# Altium project Yer_Istasyonu.PrjPcb
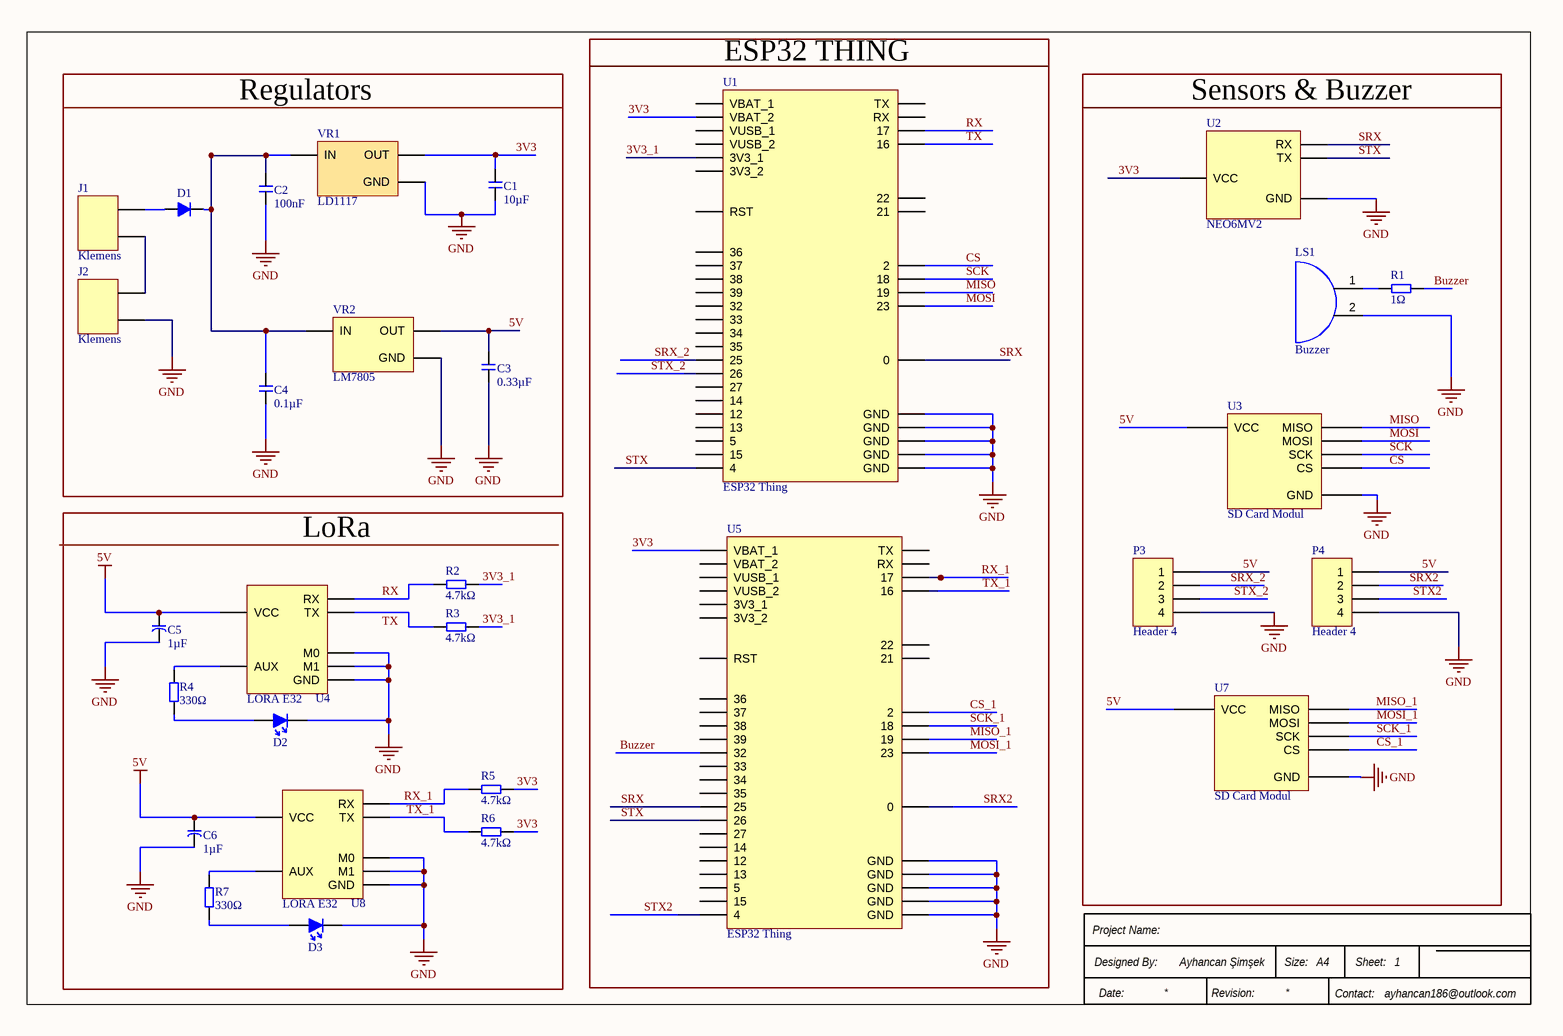
[diagram p0: Sheet1.SchDoc]
1 sheet, 30 parts. Net scope: global (net labels, ports and power ports of the same name join across sheets).
Board file: PCB1.PcbDoc

## Sheet Sheet1.SchDoc
size A4; SheetNumber: 1; SheetTotal: 1

### Parts
C1  10µF  [LCapacitor]
C2  100nF  [LCapacitor]
C3  0.33µF  [LCapacitor]
C4  0.1µF  [LCapacitor]
C5  1µF  [Capacitor]
C6  1µF  [Capacitor]
D1  Diode  [Zener]  (value not drawn)
D2  Led  [LED]  (value not drawn)
D3  Led  [LED]  (value not drawn)
J1  Klemens  [Klemens]
J2  Klemens  [Klemens]
LS1  Buzzer  [Buzzer]
P3  Header 4  [HDR1X4]
P4  Header 4  [HDR1X4]
R1  1Ω  [Resistor]
R2  4.7kΩ  [Resistor]
R3  4.7kΩ  [Resistor]
R4  330Ω  [Resistor]
R5  4.7kΩ  [Resistor]
R6  4.7kΩ  [Resistor]
R7  330Ω  [Resistor]
U1  ESP32 Thing  [ESP32 THING]
U2  NEO6MV2  [NEO6MV2]
U3  SD Card Modul  [SD Card Modülü]
U4  LORA E32  [LORAE32]
U5  ESP32 Thing  [ESP32 THING]
U7  SD Card Modul  [SD Card Modülü]
U8  LORA E32  [LORAE32]
VR1  LD1117  [LD1117]
VR2  LM7805  [LM7805]

### Blocks framed on the sheet
Regulators: C1-C4 D1 J1 J2 VR1 VR2
ESP32 THING: U1 U5
Sensors & Buzzer: LS1 P3 P4 R1 U2 U3 U7
LoRa: C5 C6 D2 D3 R2-R7 U4 U8

### Nets
5V: C3.2 C5.1 C6.1 P3.1 P4.1 U3.0(VCC) U4.2(VCC) U7.0(VCC) U8.2(VCC) VR2.3(OUT)
GND: C1.1 C2.1 C3.1 C4.1 C5.2 C6.2 D2.1 D3.1 J2.1 LS1.2 P3.4 P4.4 U1.GND_1(GND) U1.GND_2(GND) U1.GND_3(GND) U1.GND_4(GND) U1.GND_5(GND) U2.4(GND) U3.5(GND) U4.1(GND) U4.6(M1) U4.7(M0) U5.GND_1(GND) U5.GND_2(GND) U5.GND_3(GND) U5.GND_4(GND) U5.GND_5(GND) U7.5(GND) U8.1(GND) U8.6(M1) U8.7(M0) VR1.3(GND) VR2.2(GND)
3V3: C1.2 R5.2 R6.2 U1.VBAT_2 U2.1(VCC) U5.VBAT_1 VR1.2(OUT)
3V3_1: R2.2 R3.2 U1.3V3_1
Buzzer: R1.1 U5.32
CS: U1.2 U3.4(CS)
CS_1: U5.2 U7.4(CS)
MISO: U1.19 U3.3(MISO)
MISO_1: U5.19 U7.3(MISO)
MOSI: U1.23 U3.2(MOSI)
MOSI_1: U5.23 U7.2(MOSI)
RX: R2.1 U1.17 U4.5(RX)
RX_1: R5.1 U5.17 U8.5(RX)
SCK: U1.18 U3.1(SCK)
SCK_1: U5.18 U7.1(SCK)
SRX: U1.0 U2.2(RX) U5.25
SRX2: P4.2 U5.0
SRX_2: P3.2 U1.25
STX: U1.4 U2.3(TX) U5.26
STX2: P4.3 U5.4
STX_2: P3.3 U1.26
TX: R3.1 U1.16 U4.4(TX)
TX_1: R6.1 U5.16 U8.4(TX)
NetC2_2: C2.2 C4.2 D1.2 VR1.1(IN) VR2.1(IN)
NetD1_1: D1.1 J1.0
NetD2_2: D2.2 R4.1
NetD3_2: D3.2 R7.1
NetJ1_1: J1.1 J2.0
NetLS1_1: LS1.1 R1.2
NetR4_2: R4.2 U4.3(AUX)
NetR7_2: R7.2 U8.3(AUX)

Not connected (* = marked no-connect by the designer): U1 3V3_2 5 12 13 14 15 21 22 27 32 33 34 35 36 37 38 39 RST RX TX VBAT_1 VUSB_1 VUSB_2; U5 3V3_1 3V3_2 5 12 13 14 15 21 22 27 33 34 35 36 37 38 39 RST RX TX VBAT_2 VUSB_1 VUSB_2

### Notes on the sheet
- Date:
- Project Name:
- Designed By:
- Ayhancan Şimşek
- Revision:
- Size:
- A4
- Contact:
- Sheet:
- ayhancan186@outlook.com

### Library data of the parts
C1-C4 = Capacitor
C5 C6 = DCapacitor
P3 P4 = Header 4: Header, 4-Pin; LatestRevisionDate: 17-Jul-2002; LatestRevisionNote: Re-released for DXP Platform.; Publisher: Altium Limited
R1-R7 = Resistor
U1 U5 = ESP32 Thing: ESP32 802.11 Wireless LAN/Combo Wireless Module Development Kit; Manufacturer: SparkFun; Manufacturer Part Number: DEV-13907; Frequency: 2.4GHz; Supplier 1: Digi-Key; RoHS: No; Category: RF Semiconductors and Devices; Stock 1: 568; Pricing 1: 1=23,50000 (USD); ComponentLink1URL: https://github.com/sparkfun/ESP32_Thing?src-supplier=Digi-Key; ComponentLink1Description: https://github.com/sparkfun/ESP32_Thing?src-supplier=Digi-Key; Supplier Part Number 1: 1568-1444-ND
U2 = NEO6MV2: U#NEO-6M Gps Module U-BLOX6 SMD24P; Manufacturer: u-blox; Manufacturer Part Number: NEO-6M-0; Supplier 1: Mouser; RoHS: Yes; Stock 1: 236; Pricing 1: 1=60,00000, 10=41,87000, 50=27,23000, 100=17,72000, 1000=17,72000, 10000=17,72000 (USD); RoHS Compliant: Yes; Supplier Part Number 1: 377-NEO-6M-0
U4 U8 = LORA E32: WiFi-Modul 802.11/BT 2, 4-2, 5GHz 150Mb/s; Manufacturer: Espressif Systems; Manufacturer Part Number: ESP32-S3-WROOM-1-N16R8; Supplier 1: Digi-Key; RoHS: No; Category: Uncategorized; Stock 1: 327; Pricing 1: 1=4,29000 (USD); Supplier Part Number 1: 1965-ESP32-S3-WROOM-1-N16R8CT-ND
VR1 = LD1117: LDO Regulator Pos 3.3V 1.3A 3-Pin(3+Tab) TO-220 Tube (Alt: LD1117V33C); Manufacturer: STMicroelectronics; Number of Outputs: 1; Max Input Voltage: 15V; Max Power Dissipation: 12W; Polarity: Positive; Quiescent Current: 10mA; Accuracy: 1%; Output Type: Fixed; Output Current: 800mA; Dropout Voltage: 1.1V; Input Bias Current: 5mA; Supplier 1: Digi-Key; Manufacturer Part Number: LD1117V33C; RoHS: Yes; Category: Voltage Regulators - Linear; Stock 1: 30; Pricing 1: 1=0,84000, 10=0,74000, 25=0,69520, 100=0,56750, 250=0,52708, 500=0,44860, 1000=0,37030 (USD); Mount: Through Hole; Case/Package: TO; Number of Pins: 3; Weight: 0.02lb; Min Operating Temperature: -40°C; Max Operating Temperature: 125°C; Output Voltage: 3.3V; Max Output Current: 1.3A; Packaging: Rail/Tube; Number of Regulators: 1; Package Quantity: 50; Nominal Output Voltage: 3.3V; Power Dissipation: 12W; Min Output Voltage: 3.3V; Output Voltage Accuracy: 1%; Series: -; Length: 10.4mm; Width: 4.6mm; Height: 9.15mm; Radiation Hardening: No; RoHS Compliant: Yes; REACH SVHC: No SVHC; Lead Free: Lead Free; ComponentLink1URL: https://datasheet.ciiva.com/1511/1776449-1511580.pdf?src-supplier=Element14; ComponentLink1Description: https://datasheet.ciiva.com/1511/1776449-1511580.pdf?src-supplier=Element14; ComponentLink2URL: https://datasheet.ciiva.com/16226/cd00000544-16226333.pdf?src-supplier=Future+Electronics; ComponentLink2Description: https://datasheet.ciiva.com/16226/cd00000544-16226333.pdf?src-supplier=Future+Electronics; ComponentLink3URL: https://datasheet.ciiva.com/2044/cd00000544-2044110.pdf?src-supplier=Digi-Key; ComponentLink3Description: https://datasheet.ciiva.com/2044/cd00000544-2044110.pdf?src-supplier=Digi-Key; Supplier Part Number 1: 497-1492-5-ND
VR2 = LM7805: LM78XX Series 5 V Fixed Output 1 A 3-Terminal LDO Voltage Regulator - TO-220; Manufacturer: ON Semiconductor / Fairchild; Manufacturer Part Number: LM7805CT; Output Voltage: 5V; Number of Outputs: 1; Max Input Voltage: 35V; Output Current: 1A; Min Input Voltage: 7V; Polarity: Positive; Dropout Voltage: 2V; Quiescent Current: 8mA; Accuracy: 4%; Power Supply Rejection Ratio (PSRR): 73dB; Max Output Voltage: 5.2V; Supplier 1: Digi-Key; RoHS: Yes; Category: Voltage Regulators - Linear; Mount: Through Hole; Case/Package: TO-220-3; Number of Pins: 3; Weight: 1.214g; Min Operating Temperature: -40°C; Max Operating Temperature: 125°C; Packaging: Rail/Tube; Output Type: Fixed; Max Output Current: 1A; Number of Regulators: 1; Output Voltage Accuracy: 4%; Package Quantity: 50; Current Rating: 1A; Nominal Output Voltage: 5V; Min Output Voltage: 5V; Length: 10.67mm; Width: 4.7mm; Height: 16.3mm; Radiation Hardening: No; RoHS Compliant: Yes; Lead Free: Lead Free; REACH SVHC: No SVHC; ComponentLink1URL: https://datasheet.ciiva.com/19456/786138-19456361.pdf?src-supplier=Jameco; ComponentLink1Description: https://datasheet.ciiva.com/19456/786138-19456361.pdf?src-supplier=Jameco; ComponentLink2URL: https://datasheet.ciiva.com/1512/1855686-1512105.pdf?src-supplier=Element14; ComponentLink2Description: https://datasheet.ciiva.com/1512/1855686-1512105.pdf?src-supplier=Element14; ComponentLink3URL: https://datasheet.ciiva.com/1512/1855686-1512106.pdf?src-supplier=Element14; ComponentLink3Description: https://datasheet.ciiva.com/1512/1855686-1512106.pdf?src-supplier=Element14; ComponentLink4URL: https://datasheet.ciiva.com/1511/1855686-1511835.pdf?src-supplier=Element14; ComponentLink4Description: https://datasheet.ciiva.com/1511/1855686-1511835.pdf?src-supplier=Element14; ComponentLink5URL: https://datasheet.ciiva.com/8239/lm7812-8239478.pdf?src-supplier=Avnet; ComponentLink5Description: https://datasheet.ciiva.com/8239/lm7812-8239478.pdf?src-supplier=Avnet; ComponentLink6URL: https://datasheet.ciiva.com/17332/lm7805-17332792.pdf?src-supplier=Future+Electronics; ComponentLink6Description: https://datasheet.ciiva.com/17332/lm7805-17332792.pdf?src-supplier=Future+Electronics; ComponentLink7URL: https://datasheet.ciiva.com/2039/lm7805-2039365.pdf?src-supplier=Digi-Key; ComponentLink7Description: https://datasheet.ciiva.com/2039/lm7805-2039365.pdf?src-supplier=Digi-Key; ComponentLink8URL: https://datasheet.ciiva.com/48694/001253095-da-01-en-ic-reg-ldo-5v-1a-lm7805ct-to-220-3-fsc-48694790.pdf?src-supplier=Conrad; ComponentLink8Description: https://datasheet.ciiva.com/48694/001253095-da-01-en-ic-reg-ldo-5v-1a-lm7805ct-to-220-3-fsc-48694790.pdf?src-supplier=Conrad; Supplier Part Number 1: LM7805CT-ND
U3 U7 = SD Card Modul: ComponentLink1Description: Datasheet; ComponentLink1URL: https://www.robolinkmarket.com/mikro-sd-kart-modulu?gclid=CjwKCAiAmuKbBhA2EiwAxQnt78OaB-zGV_fY0ZC8aCN55WRXhNGCRLTzrWpBnvPU45m0bp0klij65RoCjc0QAvD_BwE